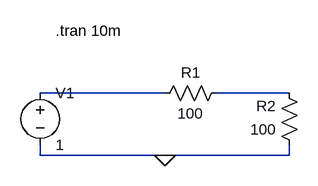
[diagram p0: schematic Potential Divider.asc]
Potential Divider.asc, the LTspice schematic file:
Version 4
SHEET 1 880 680
WIRE 160 256 -32 256
WIRE 352 256 240 256
WIRE -32 352 -32 336
WIRE 160 352 -32 352
WIRE 352 352 352 336
WIRE 352 352 160 352
FLAG 160 352 0
SYMBOL voltage -32 240 R0
SYMATTR InstName V1
SYMATTR Value 1
SYMBOL Res 256 240 R90
WINDOW 0 0 56 VBottom 2
WINDOW 3 32 56 VTop 2
SYMATTR InstName R1
SYMATTR Value 100
SYMBOL Res 368 352 R180
WINDOW 0 36 76 Left 2
WINDOW 3 36 40 Left 2
SYMATTR InstName R2
SYMATTR Value 100
TEXT -8 160 Left 2 !.tran 10m

The netlist it stands for:
* Potential Divider.asc
V1 N001 0 1
R1 N002 N001 100
R2 0 N002 100
.tran 10m
.backanno
.end